# EAGLE schematic GeekconX (EAGLE 6.1)
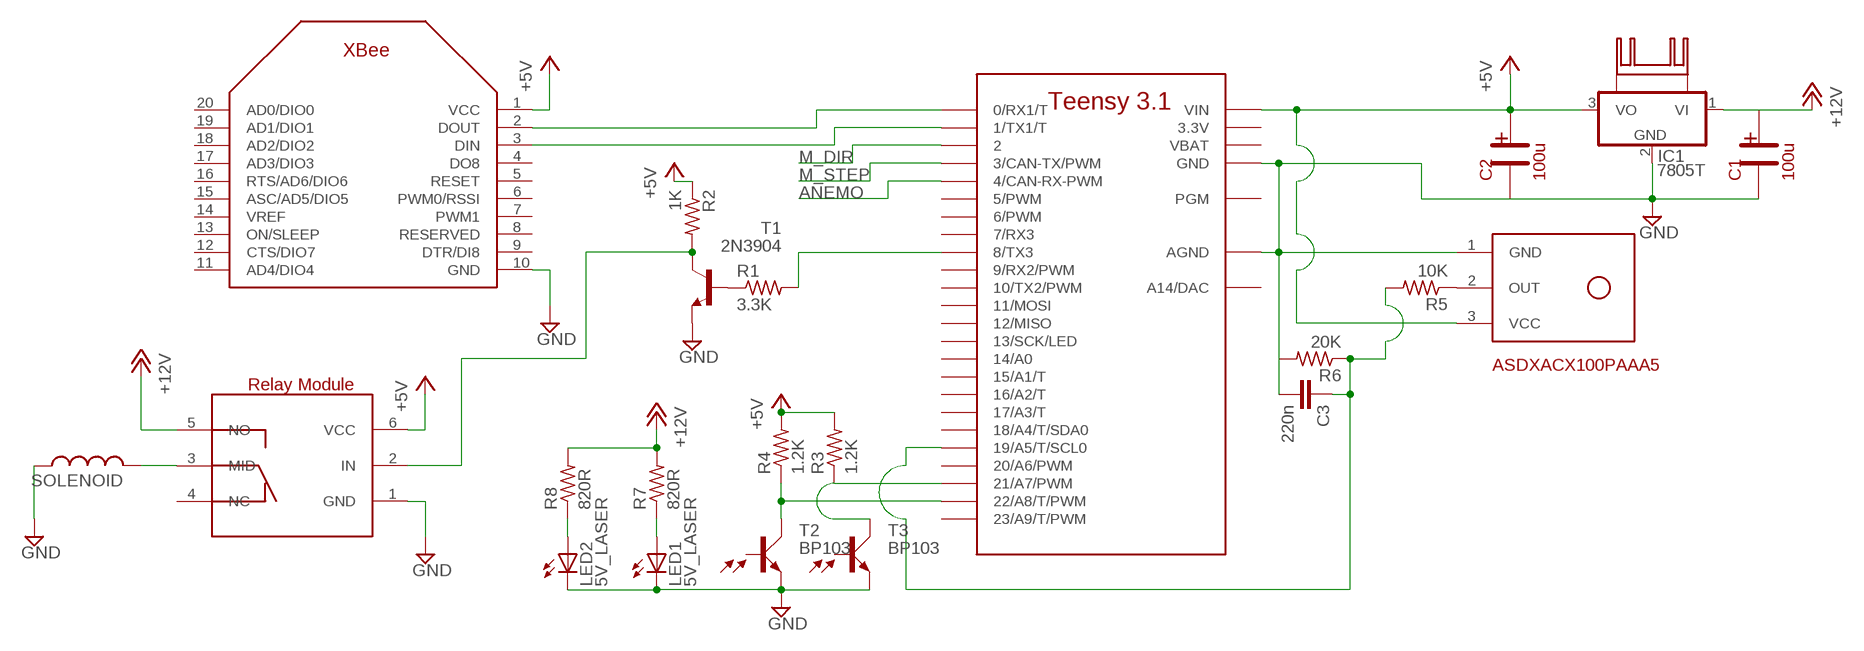
[diagram p0: schematic, sheet 1]

## Parts
C1  100u  CAP-10MM-5LS-ELECTRO  [CAP-10MM-5LS-ELECTRO]
C2  100u  CAP-10MM-5LS-ELECTRO  [CAP-10MM-5LS-ELECTRO]
C3  220n  C2,5-3  [C2.5-3]
IC1  7805T  [TO220H]
KK1  FK218  [FK218]
LED1  5V_LASER  LEDB156  [Q62902-B156]
LED2  5V_LASER  LEDB156  [Q62902-B156]
R1  3.3K  R-US_0204/5  [0204/5]
R2  1K  R-US_0204/5  [0204/5]
R3  1.2K  R-US_0204/5  [0204/5]
R4  1.2K  R-US_0204/5  [0204/5]
R5  10K  R-US_0204/5  [0204/5]
R6  20K  R-US_0204/5  [0204/5]
R7  820R  R-US_0204/5  [0204/5]
R8  820R  R-US_0204/5  [0204/5]
R$1  RELAY  [XBEE-1]
SOLENOID  L-US0204/5  [0204/5]
T1  2N3904  [TO92]
T2  BP103  [BP103]
T3  BP103  [BP103]
U1  TEENSY_3.1_BASIC  [TEENSY_3.1_BASIC]
U2  XBEE  [XBEE]
U$1  PRESSURE  [XBEE-1]

## Nets
+5V: C2.P$1 IC1.3(VO) R2.1 R3.2 R4.2 R$1.6(VCC) U1.VIN U2.1(VCC)
+12V: IC1.1(VI) R7.2 R8.2 R$1.5(NO)
ANEMO: U1.4(4/CAN-RX-PWM)
GND: C1.P$2 C3.2 IC1.2(GND) LED1.K(C) LED2.K(C) R6.2 R$1.1(GND) SOLENOID.1 T1.3(E) T2.E T3.E U1.AGND U1.GND U1.GND1(GND) U2.10(GND) U$1.1(GND)
M_DIR: U1.2
M_STEP: U1.3(3/CAN-TX/PWM)
N$1: U1.0(0/RX1/T) U2.2(DOUT)
N$2: U1.1(1/TX1/T) U2.3(DIN)
N$3: R1.2 U1.8(8/TX3)
N$4: R1.1 T1.2(B)
N$6: R3.1 T3.C U1.21/A7(21/A7/PWM)
N$7: R4.1 T2.C U1.22/A8(22/A8/T/PWM)
N$8: U$1.3(VCC)
N$9: R$1.3(MID) SOLENOID.2
N$10: R5.1 U$1.2(OUT)
N$11: LED2.A R8.1
N$12: C3.1 R5.2 R6.1 U1.19/A5(19/A5/T/SCL0)
N$13: LED1.A R7.1
N$15: R2.2 R$1.2(IN) T1.1(C)
Unconnected: C1.P$1 C2.P$2 KK1.A2,2(K) KK1.B2,2(K) R$1.4(NC) T2.B T3.B U1.5(5/PWM) U1.6(6/PWM) U1.7(7/RX3) U1.9(9/RX2/PWM) U1.10(10/TX2/PWM) U1.11(11/MOSI) U1.12(12/MISO) U1.13(13/SCK/LED) U1.14/A0 U1.15/A1(15/A1/T) U1.16/A2(16/A2/T) U1.17/A3(17/A3/T) U1.18/A4(18/A4/T/SDA0) U1.20/A6(20/A6/PWM) U1.23/A9(23/A9/T/PWM) U1.A14(A14/DAC) U1.PGM U2.4(DO8) U2.5(RESET) U2.6(PWM0/RSSI) U2.7(PWM1) U2.8(RESERVED) U2.9(DTR/DI8) U2.11(AD4/DIO4) U2.12(CTS/DIO7) U2.13(ON/SLEEP) U2.14(VREF) U2.15(ASC/AD5/DIO5) U2.16(RTS/AD6/DIO6) U2.17(AD3/DIO3) U2.18(AD2/DIO2) U2.19(AD1/DIO1) U2.20(AD0/DIO0)

## Notes on the sheet
- Teensy 3.1

## Power pins joined to a net without a drawn wire
3.3V: U1.3.3V U1.3.3V1(3.3V)
VBAT: U1.VBAT

## Library data of the parts
C1 C2 = F2624:CAP-10MM-5LS-ELECTRO: electro cap 10mm 5LS
C3 = capacitor-wima:C: CAPACITOR naming: grid - package width
IC1 = linear:78*: Positive VOLTAGE REGULATOR Source: http://cache.national.com/ds/LM/LM78L05.pdf http://www.fairchildsemi.com/ds/LM/LM7805.pdf
KK1 = heatsink:FK218: HEATSINK manufacturer Fischer/distributor Buerklin
LED1 LED2 = adafruit:LED: LED OSRAM: - CHIPLED LG R971, LG N971, LY N971, LG Q971, LY Q971, LO R971, LY R971 LH N974, LH R974 LS Q976, LO Q976, LY Q976 LO Q996 - Hyper CHIPLED LW Q18S LB Q993, LB Q99A, LB R99A - SideLED LS A670, LO A670, LY A670, LG A670, LP A670 LB A673, LV A673, LT A673, LW A673 LH A674 LY A675 LS A676, LA A676, LO A676, LY A676, LW A676 LS A679, LY A679, LG A679 - Hyper Micro SIDELED® LS Y876, LA Y876, LO Y876, LY Y876 LT Y87S - SmartLED LW L88C, LW L88S LB L89C, LB L89S, LG L890 LS L89K, LO L89K, LY L89K LS L896, LA L896, LO L896, LY L896 - TOPLED LS T670, LO T670, LY T670, LG T670, LP T670 LSG T670, LSP T670, LSY T670, LOP T670, LYG T670 LG T671, LOG T671, LSG T671 LB T673, LV T673, LT T673, LW T673 LH T674 LS T676, LA T676, LO T676, LY T676, LB T676, LH T676, LSB T676, LW T676 LB T67C, LV T67C, LT T67C, LS T67K, LO T67K, LY T67K, LW E67C LS E67B, LA E67B, LO E67B, LY E67B, LB E67C, LV E67C, LT E67C LW T67C LS T679, LY T679, LG T679 LS T770, LO T770, LY T770, LG T770, LP T770 LB T773, LV T773, LT T773, LW T773 LH T774 LS E675, LA E675, LY E675, LS T675 LS T776, LA T776, LO T776, LY T776, LB T776 LHGB T686 LT T68C, LB T68C - Hyper Mini TOPLED® LB M676 - Mini TOPLED Santana® LG M470 LS M47K, LO M47K, LY M47K Source: http://www.osram.convergy.de/
R1-R8 = adafruit:R-US_: RESISTOR, American symbol
R$1 = Xbee:RELAY
SOLENOID = resistor:L-US: INDUCTOR, American symbol
T1 = transistor:2N3904: NPN TRANSISTOR
T2 T3 = opto-trans-siemens:BP103: PHOTO TRANSISTOR; OC_FARNELL: unknown; OC_NEWARK: unknown
U1 = Teensy_3_Series_Board_v1.0:TEENSY_3.1_BASIC: Footprint for Teensy 3.1 board using all pin connections on the outer perimeter
U2 = adafruit:XBEE
U$1 = Xbee:PRESSURE